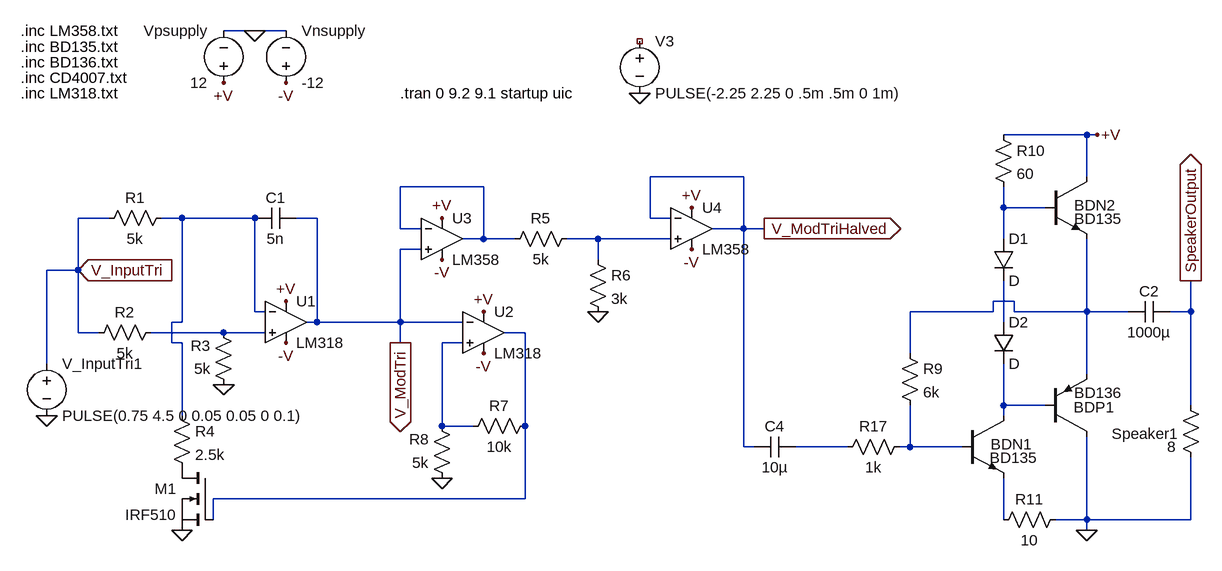
[diagram p0: schematic VCO+PowerAmp.asc]
VCO+PowerAmp.asc, the LTspice schematic file:
Version 4
SHEET 1 1768 1424
WIRE -352 16 -400 16
WIRE -304 16 -352 16
WIRE 928 176 800 176
WIRE 944 176 928 176
WIRE 400 240 256 240
WIRE 928 240 928 176
WIRE 0 256 -128 256
WIRE 800 288 800 256
WIRE 864 288 800 288
WIRE -576 304 -624 304
WIRE -464 304 -496 304
WIRE -352 304 -464 304
WIRE -256 304 -288 304
WIRE 256 304 256 240
WIRE 288 304 256 304
WIRE -128 320 -128 256
WIRE -96 320 -128 320
WIRE 400 320 400 240
WIRE 400 320 352 320
WIRE 432 320 400 320
WIRE 0 336 0 256
WIRE 0 336 -32 336
WIRE 48 336 0 336
WIRE 176 336 128 336
WIRE 288 336 176 336
WIRE 800 336 800 288
WIRE -96 352 -128 352
WIRE 176 368 176 336
WIRE -624 384 -624 304
WIRE -624 384 -672 384
WIRE 816 432 784 432
WIRE -352 448 -352 304
WIRE -336 448 -352 448
WIRE 784 448 784 432
WIRE 784 448 656 448
WIRE 816 448 816 432
WIRE 928 448 928 336
WIRE 928 448 816 448
WIRE 992 448 928 448
WIRE 1088 448 1088 400
WIRE 1088 448 1056 448
WIRE -464 464 -464 304
WIRE -464 464 -480 464
WIRE -256 464 -256 304
WIRE -256 464 -272 464
WIRE -128 464 -128 352
WIRE -128 464 -256 464
WIRE -32 464 -128 464
WIRE 800 464 800 400
WIRE -624 480 -624 384
WIRE -592 480 -624 480
WIRE -400 480 -512 480
WIRE -336 480 -400 480
WIRE 64 480 32 480
WIRE -480 496 -480 464
WIRE -464 496 -480 496
WIRE -128 496 -128 464
WIRE -32 496 -64 496
WIRE 656 512 656 448
WIRE -672 528 -672 384
WIRE 928 544 928 448
WIRE 800 592 800 528
WIRE 864 592 800 592
WIRE 1088 592 1088 448
WIRE -464 608 -464 496
WIRE 800 608 800 592
WIRE -64 624 -64 496
WIRE -16 624 -64 624
WIRE 64 624 64 480
WIRE 400 656 400 320
WIRE 416 656 400 656
WIRE 560 656 480 656
WIRE 656 656 656 592
WIRE 656 656 640 656
WIRE 736 656 656 656
WIRE 64 736 64 624
WIRE 64 736 -416 736
WIRE -416 768 -416 736
WIRE 800 768 800 704
WIRE 928 768 928 640
WIRE 928 768 880 768
WIRE 1088 768 1088 672
WIRE 1088 768 928 768
WIRE 928 784 928 768
FLAG -352 16 0
FLAG -400 96 +V
FLAG -304 96 -V
FLAG 240 112 0
FLAG -64 304 +V
FLAG -64 368 -V
FLAG 176 448 0
FLAG 320 288 +V
FLAG 320 352 -V
FLAG 432 320 V_ModTriHalved
IOPIN 432 320 Out
FLAG -400 560 0
FLAG -464 784 0
FLAG -64 704 0
FLAG -672 608 0
FLAG -304 432 +V
FLAG 0 448 +V
FLAG -304 496 -V
FLAG 0 512 -V
FLAG -128 496 V_ModTri
IOPIN -128 496 Out
FLAG -624 384 V_InputTri
IOPIN -624 384 In
FLAG 944 176 +V
FLAG 1088 400 SpeakerOutput
IOPIN 1088 400 Out
FLAG 928 784 0
SYMBOL voltage -304 112 M180
WINDOW 0 24 96 Left 2
WINDOW 3 24 16 Left 2
WINDOW 123 0 0 Left 2
WINDOW 39 0 0 Left 2
SYMATTR InstName Vnsupply
SYMATTR Value -12
SYMBOL voltage -400 112 R180
WINDOW 0 24 96 Left 2
WINDOW 3 24 16 Left 2
WINDOW 123 0 0 Left 2
WINDOW 39 0 0 Left 2
SYMATTR InstName Vpsupply
SYMATTR Value 12
SYMBOL voltage 240 16 R0
WINDOW 123 0 0 Left 2
WINDOW 39 0 0 Left 2
SYMATTR InstName V3
SYMATTR Value PULSE(-2.25 2.25 0 .5m .5m 0 1m)
SYMBOL res 144 320 R90
WINDOW 0 0 56 VBottom 2
WINDOW 3 32 56 VTop 2
SYMATTR InstName R5
SYMATTR Value 5k
SYMBOL res 160 352 R0
SYMATTR InstName R6
SYMATTR Value 3k
SYMBOL cap 480 640 R90
WINDOW 0 0 32 VBottom 2
WINDOW 3 32 32 VTop 2
SYMATTR InstName C4
SYMATTR Value 10µ
SYMBOL res 656 640 R90
WINDOW 0 0 56 VBottom 2
WINDOW 3 32 56 VTop 2
SYMATTR InstName R17
SYMATTR Value 1k
SYMBOL Opamps\\opamp2 -64 272 R0
SYMATTR InstName U3
SYMATTR Value LM358
SYMBOL Opamps\\opamp2 320 256 R0
SYMATTR InstName U4
SYMATTR Value LM358
SYMBOL res -480 288 R90
WINDOW 0 0 56 VBottom 2
WINDOW 3 32 56 VTop 2
SYMATTR InstName R1
SYMATTR Value 5k
SYMBOL cap -288 288 R90
WINDOW 0 0 32 VBottom 2
WINDOW 3 32 32 VTop 2
SYMATTR InstName C1
SYMATTR Value 5n
SYMBOL res -496 464 R90
WINDOW 0 0 56 VBottom 2
WINDOW 3 32 56 VTop 2
SYMATTR InstName R2
SYMATTR Value 5k
SYMBOL res -384 576 R180
WINDOW 0 36 76 Left 2
WINDOW 3 36 40 Left 2
SYMATTR InstName R3
SYMATTR Value 5k
SYMBOL res -480 592 R0
SYMATTR InstName R4
SYMATTR Value 2.5k
SYMBOL res 80 608 R90
WINDOW 0 0 56 VBottom 2
WINDOW 3 32 56 VTop 2
SYMATTR InstName R7
SYMATTR Value 10k
SYMBOL res -48 720 R180
WINDOW 0 36 76 Left 2
WINDOW 3 36 40 Left 2
SYMATTR InstName R8
SYMATTR Value 5k
SYMBOL voltage -672 512 R0
WINDOW 123 0 0 Left 2
WINDOW 39 0 0 Left 2
SYMATTR InstName V_InputTri1
SYMATTR Value PULSE(0.75 4.5 0 0.05 0.05 0 0.1)
SYMBOL Opamps\\opamp2 -304 400 R0
SYMATTR InstName U1
SYMATTR Value LM318
SYMBOL Opamps\\opamp2 0 416 R0
SYMATTR InstName U2
SYMATTR Value LM318
SYMBOL nmos -416 688 M0
SYMATTR InstName M1
SYMATTR Value IRF510
SYMBOL npn3 736 608 R0
WINDOW 0 44 44 Left 2
WINDOW 3 43 65 Left 2
SYMATTR InstName BDN1
SYMATTR Value BD135
SYMBOL res 640 496 R0
SYMATTR InstName R9
SYMATTR Value 6k
SYMBOL res 784 160 R0
SYMATTR InstName R10
SYMATTR Value 60
SYMBOL res 1072 576 R0
WINDOW 0 -106 60 Left 2
WINDOW 3 -20 80 Left 2
SYMATTR InstName Speaker1
SYMATTR Value 8
SYMBOL res 896 752 R90
WINDOW 0 0 56 VBottom 2
WINDOW 3 32 56 VTop 2
SYMATTR InstName R11
SYMATTR Value 10
SYMBOL pnp 864 640 M180
WINDOW 0 44 45 Left 2
WINDOW 3 45 67 Left 2
SYMATTR InstName BDP1
SYMATTR Value BD136
SYMBOL npn3 864 240 R0
WINDOW 0 45 44 Left 2
WINDOW 3 45 65 Left 2
SYMATTR InstName BDN2
SYMATTR Value BD135
SYMBOL diode 784 336 R0
SYMATTR InstName D1
SYMBOL diode 784 464 R0
SYMATTR InstName D2
SYMBOL cap 1056 432 R90
WINDOW 0 0 32 VBottom 2
WINDOW 3 32 32 VTop 2
SYMATTR InstName C2
SYMATTR Value 1000µ
TEXT -712 16 Left 2 !.inc LM358.txt
TEXT -128 112 Left 2 !.tran 0 9.2 9.1 startup uic
TEXT -712 40 Left 2 !.inc BD135.txt
TEXT -712 64 Left 2 !.inc BD136.txt
TEXT -712 88 Left 2 !.inc CD4007.txt
TEXT -712 112 Left 2 !.inc LM318.txt

The netlist it stands for:
* VCO+PowerAmp.asc
Vnsupply -V 0 -12
Vpsupply +V 0 12
V3 NC_01 0 PULSE(-2.25 2.25 0 .5m .5m 0 1m)
R5 N004 N001 5k
R6 N004 0 3k
C4 N011 V_ModTriHalved 10µ
R17 N012 N011 1k
XU3 V_ModTri N001 +V -V N001 LM358  ; pins In+ In- V+ V- OUT
XU4 N004 V_ModTriHalved +V -V V_ModTriHalved LM358  ; pins In+ In- V+ V- OUT
R1 N003 V_InputTri 5k
C1 V_ModTri N003 5n
R2 N007 V_InputTri 5k
R3 0 N007 5k
R4 N003 P001 2.5k
R7 N008 N009 10k
R8 0 N009 5k
V_InputTri1 V_InputTri 0 PULSE(0.75 4.5 0 0.05 0.05 0 0.1)
XU1 N007 N003 +V -V V_ModTri LM318  ; pins In+ In- V+ V- OUT
XU2 N009 V_ModTri +V -V N008 LM318  ; pins In+ In- V+ V- OUT
M1 P001 N008 0 0 IRF510
Q§BDN1 N010 N012 N013 0 BD135
R9 N005 N012 6k
R10 +V N002 60
R§Speaker1 SpeakerOutput 0 8
R11 0 N013 10
Q§BDP1 0 N010 N005 0 BD136
Q§BDN2 +V N002 N005 0 BD135
D1 N002 N006 D
D2 N006 N010 D
C2 SpeakerOutput N005 1000µ
.model D D
.lib standard.dio
.model NPN NPN
.model PNP PNP
.lib standard.bjt
.model NMOS NMOS
.model PMOS PMOS
.lib standard.mos
.inc LM358.txt
.tran 0 9.2 9.1 startup uic
.inc BD135.txt
.inc BD136.txt
.inc CD4007.txt
.inc LM318.txt
.backanno
.end